# EAGLE design Cookie Synth (EAGLE 6.2)
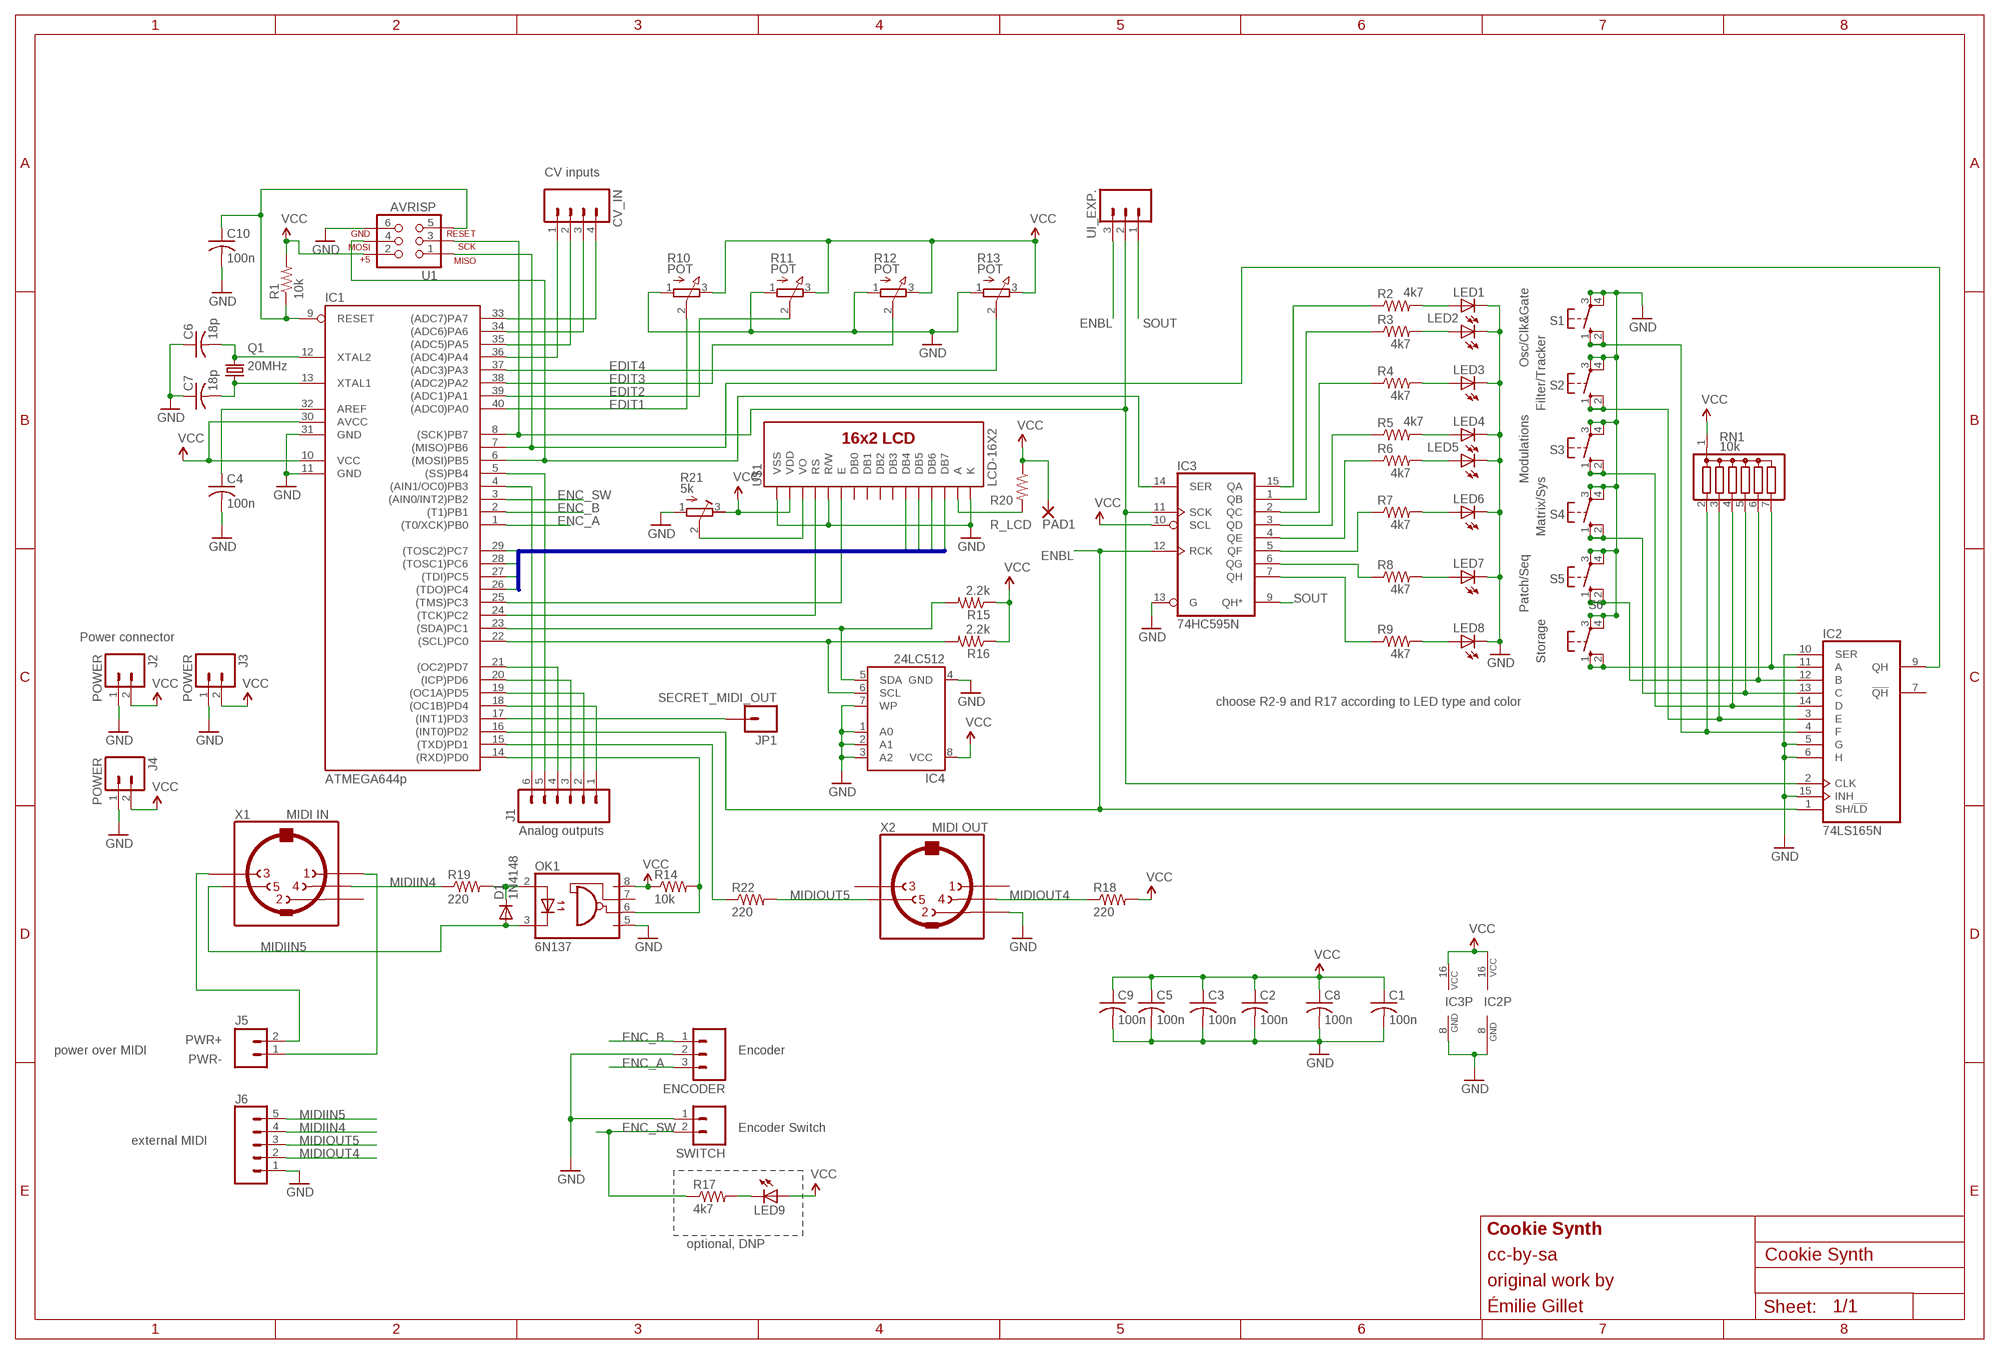
[diagram p0: schematic, sheet 1]

## Parts
C1  100n  C-US025-024X044  [C025-024X044]
C2  100n  C-US025-024X044  [C025-024X044]
C3  100n  C-US025-024X044  [C025-024X044]
C4  100n  C-US025-024X044  [C025-024X044]
C5  100n  C-US025-024X044  [C025-024X044]
C6  18p  C-US025-024X044  [C025-024X044]
C7  18p  C-US025-024X044  [C025-024X044]
C8  100n  C-US025-024X044  [C025-024X044]
C9  100n  C-US025-024X044  [C025-024X044]
C10  100n  C-US025-024X044  [C025-024X044]
CV_IN  M04PTH  [1X04]
D1  1N4148  DIODE-D-5  [D-5]
ENCODER  M03PTH  [1X03]
IC1  ATMEGA644p  MEGA16-P  [DIL40]
IC2  74LS165N  [DIL16]
IC3  74HC595N  [DIL16]
IC4  24LC512  AT24CP  [DIL08]
J1  M06SIP  [1X06]
J2  POWER  M02PTH  [1X02]
J3  POWER  M02PTH  [1X02]
J4  POWER  M02PTH  [1X02]
J5  M02PTH  [1X02]
J6  CONN_05  [1X05]
JP1  SECRET_MIDI_OUT  M01PTH  [1X01]
LED1  LED3MM  [LED3MM]
LED2  LED3MM  [LED3MM]
LED3  LED3MM  [LED3MM]
LED4  LED3MM  [LED3MM]
LED5  LED3MM  [LED3MM]
LED6  LED3MM  [LED3MM]
LED7  LED3MM  [LED3MM]
LED8  LED3MM  [LED3MM]
LED9  LED3MM  [LED3MM]
OK1  6N137  [DIL08]
PAD1  1,6/0,8  [1,6/0,8]
Q1  20MHz  CRYSTALHC49U-V  [HC49U-V]
R1  10k  R-US_0204/7  [0204/7]
R2  4k7  R-US_0204/7  [0204/7]
R3  4k7  R-US_0204/7  [0204/7]
R4  4k7  R-US_0204/7  [0204/7]
R5  4k7  R-US_0204/7  [0204/7]
R6  4k7  R-US_0204/7  [0204/7]
R7  4k7  R-US_0204/7  [0204/7]
R8  4k7  R-US_0204/7  [0204/7]
R9  4k7  R-US_0204/7  [0204/7]
R10  POT  POTI_ALPS_RK09  [POTI_ALPS_RK09]
R11  POT  POTI_ALPS_RK09  [POTI_ALPS_RK09]
R12  POT  POTI_ALPS_RK09  [POTI_ALPS_RK09]
R13  POT  POTI_ALPS_RK09  [POTI_ALPS_RK09]
R14  10k  R-US_0204/7  [0204/7]
R15  2.2k  R-US_0204/7  [0204/7]
R16  2.2k  R-US_0204/7  [0204/7]
R17  4k7  R-US_0204/7  [0204/7]
R18  220  R-US_0204/7  [0204/7]
R19  220  R-US_0204/7  [0204/7]
R20  R_LCD  R-US_0204/7  [0204/7]
R21  5k  R-TRIMM3296X  [RTRIM3296X]
R22  220  R-US_0204/7  [0204/7]
RN1  10k  G06R  [SIL7]
S1  Osc/Clk&Gate  40-XX  [B3F-40XX]
S2  Filter/Tracker  40-XX  [B3F-40XX]
S3  Modulations  40-XX  [B3F-40XX]
S4  Matrix/Sys  40-XX  [B3F-40XX]
S5  Patch/Seq  40-XX  [B3F-40XX]
S6  Storage  40-XX  [B3F-40XX]
SWITCH  M02PTH  [1X02]
U1  AVRISP  AVR_SPI_PRG_6PTH  [2X3]
U$1  LCD-16X2  [LCD-16X2]
UI_EXP.  M03PTH  [1X03]
X1  MIDI IN  MAB5SH  [MAB5SH]
X2  MIDI OUT  MAB5SH  [MAB5SH]

## Nets
EDIT1: IC1.40((ADC0)PA0) R10.2(S)
EDIT2: IC1.39((ADC1)PA1) R11.2(S)
EDIT3: IC1.38((ADC2)PA2) R12.2(S)
EDIT4: IC1.37((ADC3)PA3) R13.2(S)
ENBL: IC1.16((INT0)PD2) IC2.1(SH/!LD) IC3.12(RCK) UI_EXP..3
ENC_A: ENCODER.3 IC1.1((T0/XCK)PB0)
ENC_B: ENCODER.1 IC1.2((T1)PB1)
ENC_SW: IC1.3((AIN0/INT2)PB2) R17.1 SWITCH.2
GND: C1.2 C2.2 C3.2 C4.2 C5.2 C6.1 C7.1 C8.2 C9.2 C10.2 ENCODER.2 IC1.11(GND) IC1.31(GND) IC2.5(G) IC2.6(H) IC2.8(GND) IC2.10(SER) IC2.15(INH) IC3.8(GND) IC3.13(G) IC4.1(A0) IC4.2(A1) IC4.3(A2) IC4.4(GND) IC4.7(WP) J2.1 J3.1 J4.1 J6.1 LED1.K(C) LED2.K(C) LED3.K(C) LED4.K(C) LED5.K(C) LED6.K(C) LED7.K(C) LED8.K(C) OK1.5(GND) R10.1(A) R11.1(A) R12.1(A) R13.1(A) R21.1(E) S1.3(P) S1.4(P1) S2.3(P) S2.4(P1) S3.3(P) S3.4(P1) S4.3(P) S4.4(P1) S5.3(P) S5.4(P1) S6.3(P) S6.4(P1) SWITCH.1 U1.6 U$1.1(VSS) U$1.5(R/W) U$1.16(K) X2.2
LCD_DATA1: IC1.26((TDO)PC4) U$1.11(DB4)
LCD_DATA2: IC1.27((TDI)PC5) U$1.12(DB5)
LCD_DATA3: IC1.28((TOSC1)PC6) U$1.13(DB6)
LCD_DATA4: IC1.29((TOSC2)PC7) U$1.14(DB7)
MIDIIN4: J6.4 R19.1 X1.4
MIDIIN5: D1.A J6.5 OK1.3(C) X1.5
MIDIOUT4: J6.2 R18.1 X2.4
MIDIOUT5: J6.3 R22.2 X2.5
N$1: IC3.2(QC) R4.1
N$2: IC1.24((TCK)PC2) U$1.4(RS)
N$3: IC2.11(A) RN1.7 S6.1(S) S6.2(S1)
N$4: LED9.K(C) R17.2
N$5: IC2.3(E) RN1.3 S2.1(S) S2.2(S1)
N$6: C10.1 IC1.9(RESET) R1.1 U1.5
N$7: C4.1 IC1.32(AREF)
N$8: IC1.8((SCK)PB7) IC2.2(CLK) IC3.11(SCK) U1.3 UI_EXP..2
N$9: IC1.7((MISO)PB6) IC2.9(QH) U1.1
N$10: CV_IN.1 IC1.36((ADC4)PA4)
N$11: CV_IN.2 IC1.35((ADC5)PA5)
N$12: CV_IN.3 IC1.34((ADC6)PA6)
N$13: CV_IN.4 IC1.33((ADC7)PA7)
N$14: R20.2 U$1.15(A)
N$18: IC1.4((AIN1/OC0)PB3) J1.6
N$19: IC1.5((SS)PB4) J1.5
N$20: IC1.18((OC1B)PD4) J1.1
N$21: IC1.19((OC1A)PD5) J1.2
N$22: IC1.20((ICP)PD6) J1.3
N$23: IC1.21((OC2)PD7) J1.4
N$24: J5.1 X1.1
N$25: IC1.17((INT1)PD3) JP1.1
N$27: IC1.23((SDA)PC1) IC4.5(SDA) R15.2
N$28: D1.C OK1.2(A) R19.2
N$29: J5.2 X1.3
N$30: IC3.15(QA) R2.1
N$31: IC3.1(QB) R3.1
N$32: IC1.22((SCL)PC0) IC4.6(SCL) R16.2
N$33: IC3.3(QD) R5.1
N$34: IC3.4(QE) R6.1
N$35: IC3.5(QF) R7.1
N$36: IC3.7(QH) R9.1
N$37: IC3.6(QG) R8.1
N$42: LED1.A R2.2
N$43: LED2.A R3.2
N$44: LED3.A R4.2
N$45: LED4.A R5.2
N$46: LED5.A R6.2
N$47: LED6.A R7.2
N$48: LED7.A R8.2
N$49: LED8.A R9.2
N$57: IC1.6((MOSI)PB5) IC3.14(SER) U1.4
N$59: IC2.4(F) RN1.2 S1.1(S) S1.2(S1)
N$61: IC2.14(D) RN1.4 S3.1(S) S3.2(S1)
N$62: IC2.13(C) RN1.5 S4.1(S) S4.2(S1)
N$63: IC2.12(B) RN1.6 S5.1(S) S5.2(S1)
N$76: IC1.25((TMS)PC3) U$1.6(E)
N$78: R21.2(S) U$1.3(VO)
N$82: C7.2 IC1.13(XTAL1) Q1.1
N$83: C6.2 IC1.12(XTAL2) Q1.2
RXD: IC1.14((RXD)PD0) OK1.6(VO) R14.2
SOUT: IC3.9(QH*) UI_EXP..1
TXD: IC1.15((TXD)PD1) R22.1
VCC: C1.1 C2.1 C3.1 C5.1 C8.1 C9.1 IC1.10(VCC) IC1.30(AVCC) IC2.16(VCC) IC3.10(SCL) IC3.16(VCC) IC4.8(VCC) J2.2 J3.2 J4.2 LED9.A OK1.8(VCC) PAD1.1(P) R1.2 R10.3(E) R11.3(E) R12.3(E) R13.3(E) R14.1 R15.1 R16.1 R18.2 R20.1 R21.3(A) RN1.1 U1.2 U$1.2(VDD)
Unconnected: IC2.7(!QH) OK1.7(VE) U$1.7(DB0) U$1.8(DB1) U$1.9(DB2) U$1.10(DB3) X1.2 X2.1 X2.3

## Buses
LCD_DATA[1..4]

## Notes on the sheet
- CV inputs
- Power connector
- choose R2-9 and R17 according to LED type and color
- Analog outputs
- PWR+
- power over MIDI | PWR- | Encoder
- Encoder Switch
- external MIDI
- Cookie Synth
- optional, DNP
- cc-by-sa
- original work by
- Émilie Gillet

## Library data of the parts
C1-C10 = rcl:C-US: CAPACITOR, American symbol
CV_IN = SparkFun:M04: Header 4 Standard 4-pin 0.1" header. Use with straight break away headers (SKU : PRT-00116), right angle break away headers (PRT-00553), swiss pins (PRT-00743), machine pins (PRT-00117), and female headers (PRT-00115). Molex polarized connector foot print use with SKU : PRT-08231 with associated crimp pins and housings.
D1 = diode:DIODE-: DIODE
ENCODER UI_EXP. = SparkFun:M03: Header 3 Standard 3-pin 0.1" header. Use with straight break away headers (SKU : PRT-00116), right angle break away headers (PRT-00553), swiss pins (PRT-00743), machine pins (PRT-00117), and female headers (PRT-00115). Molex polarized connector foot print use with SKU : PRT-08232 with associated crimp pins and housings.
IC1 = atmel:MEGA16-P: MICROCONTROLLER 16 Kbytes FLASH 1 kbytes SRAM 512 bytes EEPROM USART 8-channel 10 bit ADC Source: avr.lbr
IC2 = 74xx-us:74*165: 8-bit parallel load SHIFT REGISTER
IC3 = 74xx-eu:74*595: 8-bit SHIFT REGISTER, output latch
IC4 = atmel:AT24C*: 2-wire serial EEPROM
J1 = SparkFun:M06: Header 6 Standard 6-pin 0.1" header. Use with straight break away headers (SKU : PRT-00116), right angle break away headers (PRT-00553), swiss pins (PRT-00743), machine pins (PRT-00117), and female headers (PRT-00115). Molex polarized connector foot print use with SKU : PRT-08094 with associated crimp pins and housings. NOTES ON THE VARIANTS LOCK and LOCK_LONGPADS... This footprint was designed to help hold the alignment of a through-hole component (i.e. 6-pin header) while soldering it into place. You may notice that each hole has been shifted either up or down by 0.005 of an inch from it's more standard position (which is a perfectly straight line). This slight alteration caused the pins (the squares in the middle) to touch the edges of the holes. Because they are alternating, it causes a "brace" to hold the component in place. 0.005 has proven to be the perfect amount of "off-center" position when using our standard breakaway headers. Although looks a little odd when you look at the bare footprint, once you have a header in there, the alteration is very hard to notice. Also, if you push a header all the way into place, it is covered up entirely on the bottom side. This idea of altering the position of holes to aid alignment will be further integrated into the Sparkfun Library for other footprints. It can help hold any component with 3 or more connection pins.
J2-J5 SWITCH = SparkFun:M02: Header 2 Standard 2-pin 0.1" header. Use with straight break away headers (SKU : PRT-00116), right angle break away headers (PRT-00553), swiss pins (PRT-00743), machine pins (PRT-00117), and female headers (PRT-00115). Molex polarized connector foot print use with SKU : PRT-08233 with associated crimp pins and housings.
J6 = Connectors:CONN_05: Multi connection point. Often used as Generic Header-pin footprint for 0.1 inch spaced/style header connections On any of the 0.1 inch spaced packages, you can populate with these: Break Away Headers - Straight <https://www.sparkfun.com/products/116> (PRT-00116) Break Away Male Headers - Right Angle <https://www.sparkfun.com/products/553> (PRT-00553) Female Headers <https://www.sparkfun.com/products/115> (PRT-00115) Break Away Headers - Machine Pin <https://www.sparkfun.com/products/117> (PRT-00117) Break Away Female Headers - Swiss Machine Pin <https://www.sparkfun.com/products/743> (PRT-00743) For SCREWTERMINALS and SPRING TERMINALS visit here: Screw Terimnals on SparkFun.com <https://www.sparkfun.com/search/results?term=Screw+Terminals> (5mm/3.5mm/2.54mm spacing) This device is also useful as a general connection point to wire up your design to another part of your project. Our various solder wires solder well into these plated through hole pads. Hook-Up Wire - Assortment (Stranded, 22 AWG) <https://www.sparkfun.com/products/11375> (PRT-11375) Hook-Up Wire - Assortment (Solid Core, 22 AWG) <https://www.sparkfun.com/products/11367> (PRT-11367) View the entire wire category on our website here <https://www.sparkfun.com/categories/141> Special notes: Molex polarized connector foot print use with SKU : PRT-08231 with associated crimp pins and housings. 1MM SMD Version SKU: PRT-10208
JP1 = SparkFun:M01: Header 1 Standard 1-pin 0.1" header. Use with straight break away headers (SKU : PRT-00116), right angle break away headers (PRT-00553), swiss pins (PRT-00743), machine pins (PRT-00117), and female headers (PRT-00115).
LED1-LED9 = led:LED: LED OSRAM: - CHIPLED LG R971, LG N971, LY N971, LG Q971, LY Q971, LO R971, LY R971 LH N974, LH R974 LS Q976, LO Q976, LY Q976 LO Q996 - Hyper CHIPLED LW Q18S LB Q993, LB Q99A, LB R99A - SideLED LS A670, LO A670, LY A670, LG A670, LP A670 LB A673, LV A673, LT A673, LW A673 LH A674 LY A675 LS A676, LA A676, LO A676, LY A676, LW A676 LS A679, LY A679, LG A679 - Hyper Micro SIDELED® LS Y876, LA Y876, LO Y876, LY Y876 LT Y87S - SmartLED LW L88C, LW L88S LB L89C, LB L89S, LG L890 LS L89K, LO L89K, LY L89K LS L896, LA L896, LO L896, LY L896 - TOPLED LS T670, LO T670, LY T670, LG T670, LP T670 LSG T670, LSP T670, LSY T670, LOP T670, LYG T670 LG T671, LOG T671, LSG T671 LB T673, LV T673, LT T673, LW T673 LH T674 LS T676, LA T676, LO T676, LY T676, LB T676, LH T676, LSB T676, LW T676 LB T67C, LV T67C, LT T67C, LS T67K, LO T67K, LY T67K, LW E67C LS E67B, LA E67B, LO E67B, LY E67B, LB E67C, LV E67C, LT E67C LW T67C LS T679, LY T679, LG T679 LS T770, LO T770, LY T770, LG T770, LP T770 LB T773, LV T773, LT T773, LW T773 LH T774 LS E675, LA E675, LY E675, LS T675 LS T776, LA T776, LO T776, LY T776, LB T776 LHGB T686 LT T68C, LB T68C - Hyper Mini TOPLED® LB M676 - Mini TOPLED Santana® LG M470 LS M47K, LO M47K, LY M47K Source: http://www.osram.convergy.de LUXEON: - LUMILED® LXK2-PW12-R00, LXK2-PW12-S00, LXK2-PW14-U00, LXK2-PW14-V00 LXK2-PM12-R00, LXK2-PM12-S00, LXK2-PM14-U00 LXK2-PE12-Q00, LXK2-PE12-R00, LXK2-PE12-S00, LXK2-PE14-T00, LXK2-PE14-U00 LXK2-PB12-K00, LXK2-PB12-L00, LXK2-PB12-M00, LXK2-PB14-N00, LXK2-PB14-P00, LXK2-PB14-Q00 LXK2-PR12-L00, LXK2-PR12-M00, LXK2-PR14-Q00, LXK2-PR14-R00 LXK2-PD12-Q00, LXK2-PD12-R00, LXK2-PD12-S00 LXK2-PH12-R00, LXK2-PH12-S00 LXK2-PL12-P00, LXK2-PL12-Q00, LXK2-PL12-R00 Source: www.luxeon.com KINGBRIGHT: KA-3528ASYC Source: www.kingbright.com
OK1 = optocoupler:6N137: MOTOROLA OPTO COUPLER
PAD1 = wirepad:1,6/0,8: THROUGH-HOLE PAD
Q1 = crystal:CRYSTAL: CRYSTAL
R1-R9 R14-R20 R22 = rcl:R-US_: RESISTOR, American symbol
R10-R13 = FA_potentiometer:POTI_ALPS_RK09: Potentiometer
R21 = rcl:R-TRIMM: Trimm resistor
RN1 = resistor-sil:G06R: SIL RESISTOR
S1-S6 = og-switch:40-XX: OMRON SWITCH
U1 = SparkFun:AVR_SPI_PRG_6: AVR ISP 6 Pin This is the reduced ISP connector for AVR programming. Common on Arduino. This footprint will take up less PCB space and can be used with a 10-pin to 6-pin adapter such as SKU: BOB-08508
U$1 = SparkFun:LCD-16X2
X1 X2 = og-midi:MAB5SH: Female CONNECTOR 5 pins 90 deg. with shield, horizontal (DIN 41524)

## Board
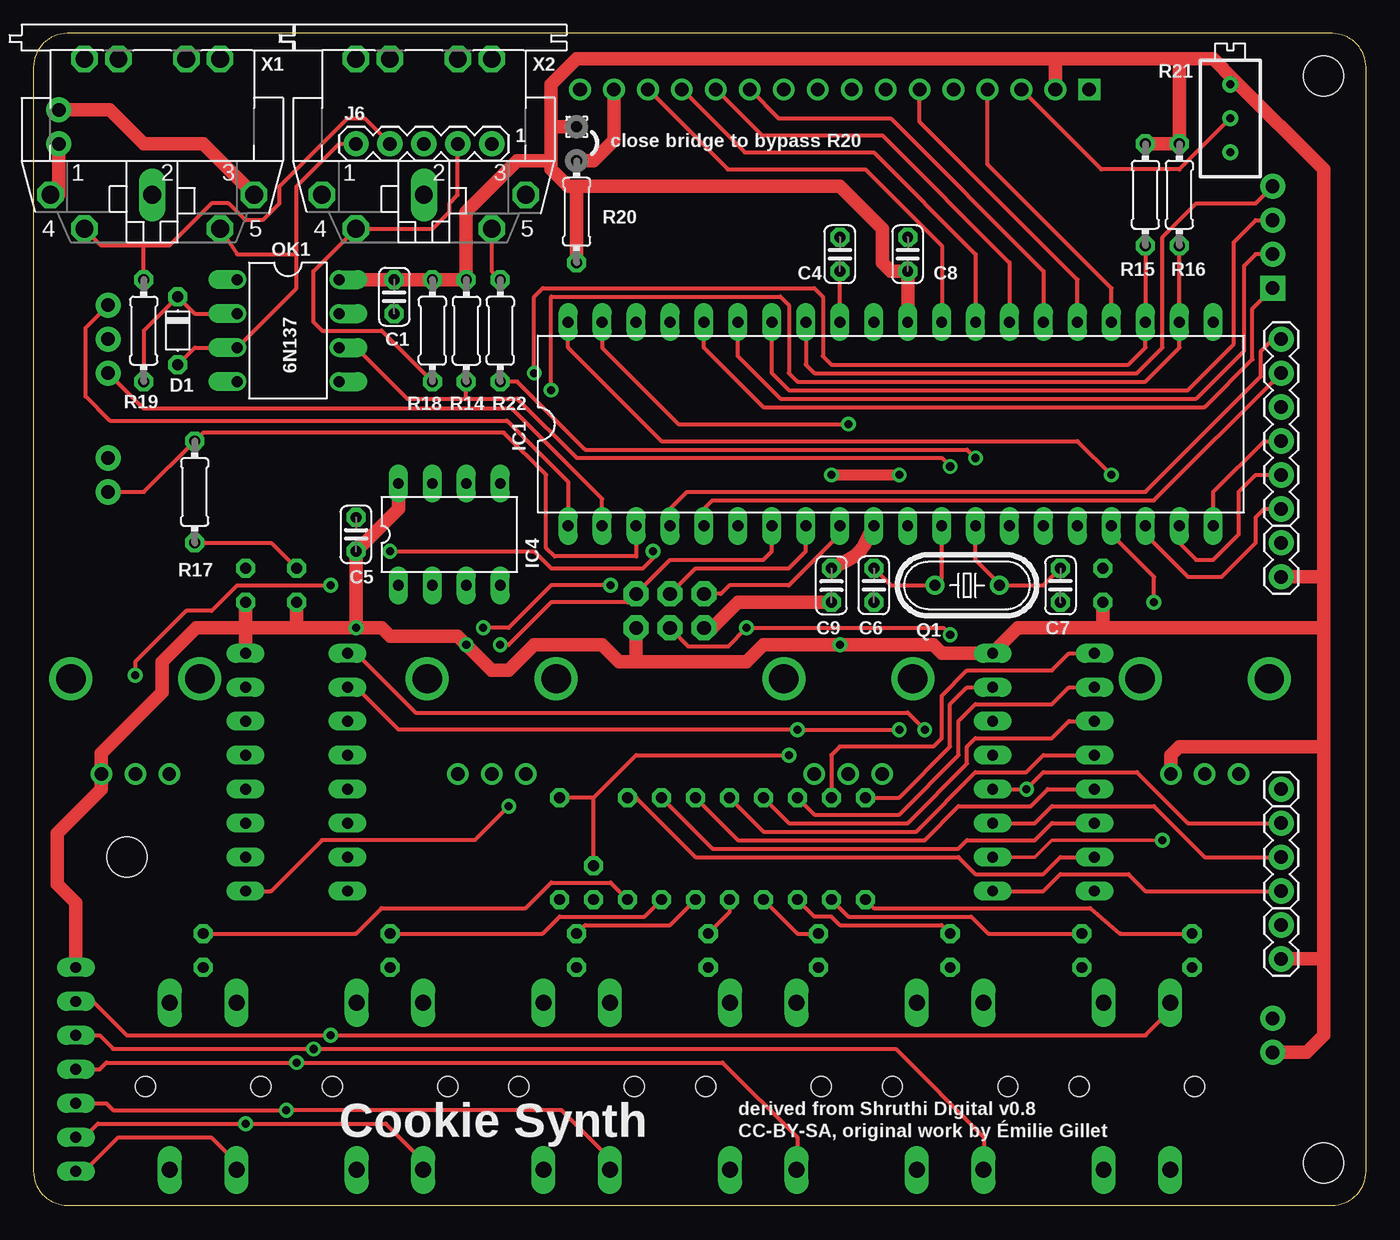
[diagram p1: board, top side]
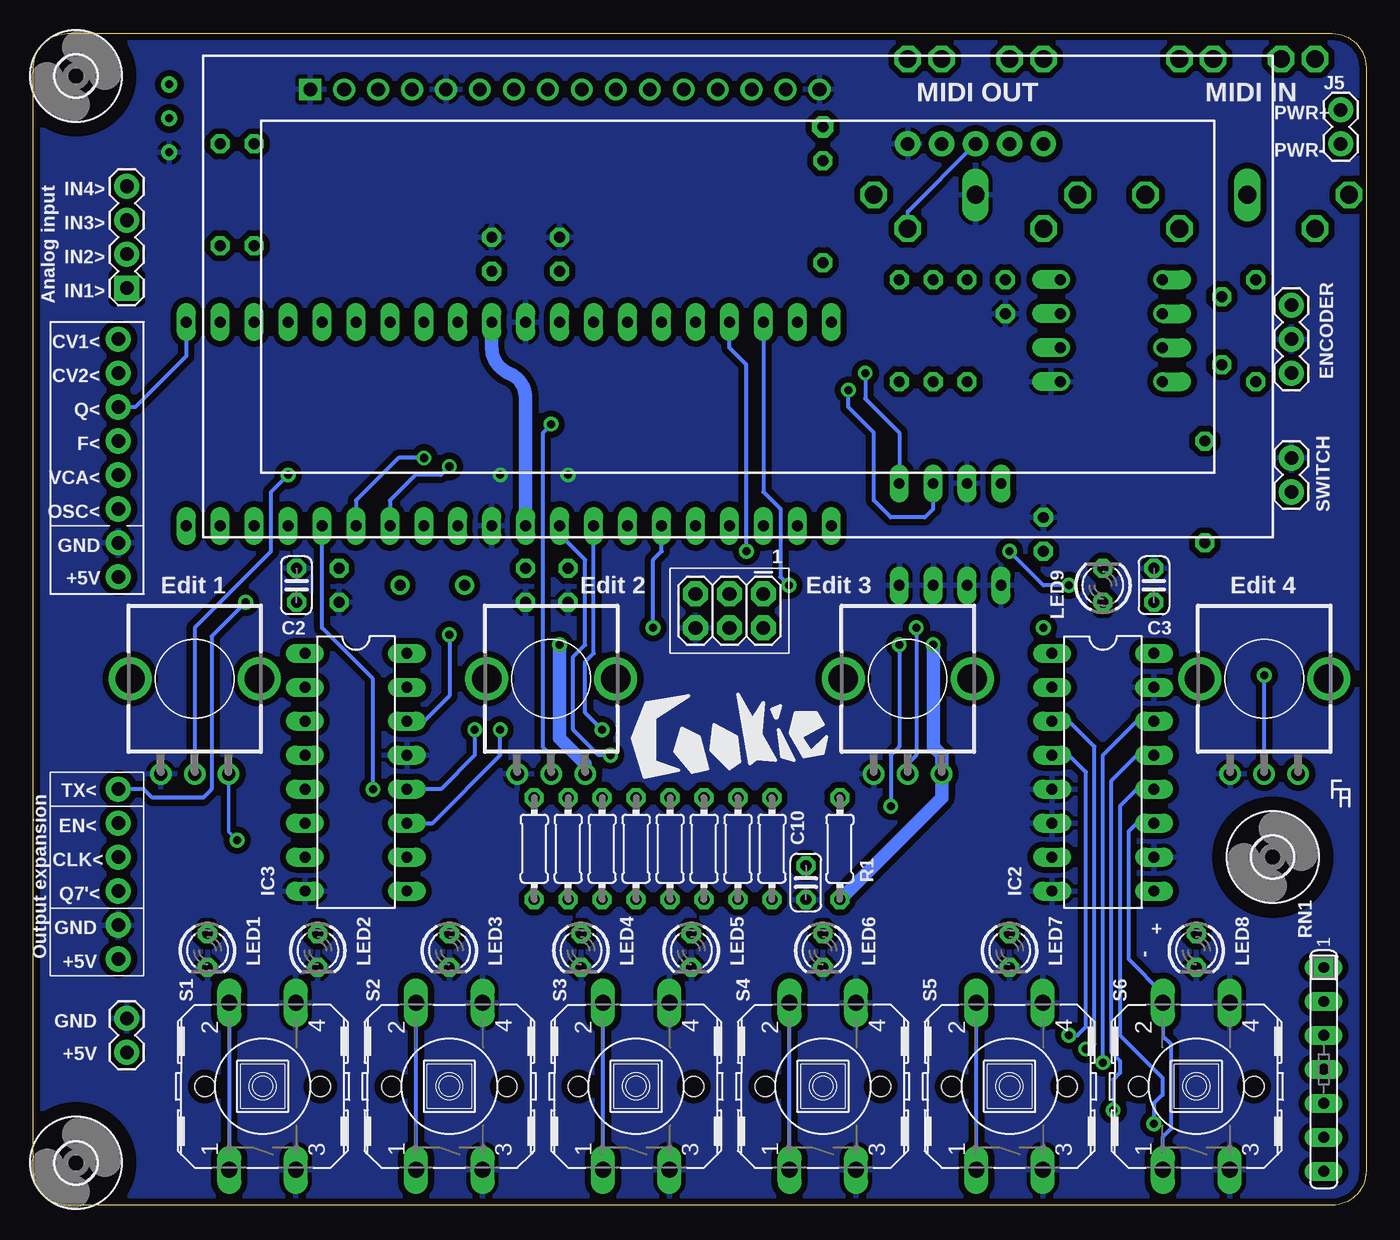
[diagram p2: board, bottom side, seen from below]

Size 99.7 x 87.63 mm. Coordinates in mm from the lower left corner, seen from the top.
Outline: 97.16,0 arc90 99.7,2.54 99.7,85.09 arc90 97.16,87.63 2.54,87.63 arc90 0,85.09 0,2.54 arc90 2.54,0 97.16,0
Copper layers (1*16): Top 0.035mm / dielectric 1.5mm / Bottom 0.035mm
Design rules: minimum track width 10mil, minimum drill 20mil, track to track 10mil, track to pad 10mil, pad to pad 10mil, via to via 10mil, smd to smd 8mil, copper to edge 20mil, drill to drill 20mil, minimum pad ring 12mil, minimum via ring 10mil, stop-mask expansion 4mil, vias tented up to drill 25mil, thermal gap 12mil
Holes 1.5 mm at 17.02,8.89 8.38,8.89 30.99,8.89 22.35,8.89 44.96,8.89 36.32,8.89 72.9,8.89 64.26,8.89 86.87,8.89 78.23,8.89 58.93,8.89 50.29,8.89
tKeepout: area 13.9,74.9 to 21.9,80.9; area 42.9,74.9 to 50.9,80.9; area 71.9,74.9 to 79.9,80.9; area 13.8,53.1 to 21.8,59.1; area 42.8,53.1 to 50.8,59.1; area 71.8,53.1 to 79.8,59.1

### Footprints (pad centres in the part's own frame; a part is rotated, then mirrored left to right if it is on the bottom)
C025-024X044 = drill 0.813 octagon: 1 -1.27,0; 2 1.27,0
1X04 = drill 1.016 pad 1.88 square: 1 0,0 | drill 1.016 pad 1.88: 2 2.54,0; 3 5.08,0; 4 7.62,0
D-5 = drill 0.813 octagon: A 2.54,0; C -2.54,0
1X03 = drill 1.016 pad 1.88: 1 0,0; 2 2.54,0; 3 5.08,0
DIL40 = drill 0.813 long: 1 -24.13,-7.62; 2 -21.59,-7.62; 3 -19.05,-7.62; 4 -16.51,-7.62; 5 -13.97,-7.62; 6 -11.43,-7.62; 7 -8.89,-7.62; 8 -6.35,-7.62; 9 -3.81,-7.62; 10 -1.27,-7.62; 11 1.27,-7.62; 12 3.81,-7.62; 13 6.35,-7.62; 14 8.89,-7.62; 15 11.43,-7.62; 16 13.97,-7.62; 17 16.51,-7.62; 18 19.05,-7.62; 19 21.59,-7.62; 20 24.13,-7.62; 21 24.13,7.62; 22 21.59,7.62; 23 19.05,7.62; 24 16.51,7.62; 25 13.97,7.62; 26 11.43,7.62; 27 8.89,7.62; 28 6.35,7.62; 29 3.81,7.62; 30 1.27,7.62; 31 -1.27,7.62; 32 -3.81,7.62; 33 -6.35,7.62; 34 -8.89,7.62; 35 -11.43,7.62; 36 -13.97,7.62; 37 -16.51,7.62; 38 -19.05,7.62; 39 -21.59,7.62; 40 -24.13,7.62
DIL16 = drill 0.813 long: 1 -8.89,-3.81; 2 -6.35,-3.81; 3 -3.81,-3.81; 4 -1.27,-3.81; 5 1.27,-3.81; 6 3.81,-3.81; 7 6.35,-3.81; 8 8.89,-3.81; 9 8.89,3.81; 10 6.35,3.81; 11 3.81,3.81; 12 1.27,3.81; 13 -1.27,3.81; 14 -3.81,3.81; 15 -6.35,3.81; 16 -8.89,3.81
DIL08 = drill 0.813 long: 1 -3.81,-3.81; 2 -1.27,-3.81; 3 1.27,-3.81; 4 3.81,-3.81; 5 3.81,3.81; 6 1.27,3.81; 7 -1.27,3.81; 8 -3.81,3.81
1X06 = drill 1.016 pad 1.88: 1 0,0; 2 2.54,0; 3 5.08,0; 4 7.62,0; 5 10.16,0; 6 12.7,0
1X02 = drill 1.016 pad 1.88: 1 0,0; 2 2.54,0
1X05 = drill 1.016 pad 1.88: 1 0,0; 2 2.54,0; 3 5.08,0; 4 7.62,0; 5 10.16,0
1X01 = drill 1.016 pad 1.88: 1 0,0
LED3MM = drill 0.813 octagon: A -1.27,0; K 1.27,0
DIL08' = drill 0.813 offset: 1 -3.81,-3.81; 2 -1.27,-3.81; 3 1.27,-3.81; 4 3.81,-3.81; 5 3.81,3.81; 6 1.27,3.81; 7 -1.27,3.81; 8 -3.81,3.81
1,6/0,8 = drill 0.813 pad 1.6 octagon: 1 0,0
HC49U-V = drill 0.813: 1 -2.413,0; 2 2.413,0
0204/7 = drill 0.813 octagon: 1 -3.81,0; 2 3.81,0
POTI_ALPS_RK09 = drill 1: 1 -2.54,-7.112; 2 0,-7.112; 3 2.54,-7.112 | drill 2.2: TAB1 -4.826,0; TAB2 4.826,0
RTRIM3296X = drill 0.61: 1 0,-2.54; 2 0,0; 3 0,2.54
SIL7 = drill 0.813 long: 1 -7.62,0; 2 -5.08,0; 3 -2.54,0; 4 0,0; 5 2.54,0; 6 5.08,0; 7 7.62,0
B3F-40XX = drill 1.194 long: 1 -6.248,2.489; 2 6.248,2.489; 3 -6.248,-2.489; 4 6.248,-2.489
2X3 = drill 1.016 pad 1.88 octagon: 1 0,0; 2 0,2.54; 3 2.54,0; 4 2.54,2.54; 5 5.08,0; 6 5.08,2.54
LCD-16X2 = drill 1.016 square: 1 -32,15.5 | drill 1.016: 2 -29.46,15.5; 3 -26.92,15.5; 4 -24.38,15.5; 5 -21.84,15.5; 6 -19.3,15.5; 7 -16.76,15.5; 8 -14.22,15.5; 9 -11.68,15.5; 10 -9.14,15.5; 11 -6.6,15.5; 12 -4.06,15.5; 13 -1.52,15.5; 14 1.02,15.5; 15 3.56,15.5; 16 6.1,15.5
3,0 = hole 3: 0,0
MAB5SH = drill 1.321 octagon: 1 7.62,7.62; 3 -7.62,7.62; 4 5.08,10.16; 5 -5.08,10.16; P$1 -5.08,-2.54; P$2 -2.54,-2.54; P$3 2.54,-2.54; P$4 5.08,-2.54 | drill 1.321 long: 2 0,7.62

### Placement (x,y rotation side)
C1  26.99,67.95 270 top
C2  80.01,46.35 90 bottom
C3  15.87,46.35 90 bottom
C4  60.32,71.12 90 top
C5  24.13,50.16 90 top
C6  62.87,46.35 90 top
C7  76.84,46.35 90 top
C8  65.41,71.12 90 top
C9  59.69,46.35 270 top
C10  41.91,24.13 270 bottom
CV_IN  92.71,68.58 90 bottom
D1  10.79,65.41 270 top
ENCODER  5.59,62.23 90 bottom
IC1  64.14,58.42 0 top
IC2  19.69,32.38 270 bottom
IC3  75.56,32.38 270 bottom
IC4  31.11,50.16 0 top
J1  93.34,52.07 90 top
J2  93.34,49.53 270 top
J3  92.71,13.97 270 bottom
J4  93.34,20.95 270 top
J5  1.9,79.38 90 bottom
J6  34.29,79.38 180 top
JP1  93.34,31.11 90 top
LED1  86.68,19.05 270 bottom
LED2  78.42,19.05 270 bottom
LED3  68.58,19.05 270 bottom
LED4  58.74,19.05 270 bottom
LED5  50.48,19.05 270 bottom
LED6  40.64,19.05 270 bottom
LED7  26.67,19.05 270 bottom
LED8  12.7,19.05 270 bottom
LED9  19.69,46.35 90 bottom
OK1  6N137  [DIL08']  19.05,65.41 270 top
PAD1  40.64,80.65 0 top
Q1  69.85,46.35 180 top
R1  39.37,26.67 270 bottom
R2  62.23,26.67 270 bottom
R3  59.69,26.67 270 bottom
R4  57.15,26.67 270 bottom
R5  54.61,26.67 270 bottom
R6  52.07,26.67 270 bottom
R7  49.53,26.67 270 bottom
R8  46.99,26.67 270 bottom
R9  44.45,26.67 270 bottom
R10  87.63,39.37 0 bottom
R11  60.96,39.37 0 bottom
R12  34.29,39.37 0 bottom
R13  7.62,39.37 0 bottom
R14  32.38,65.41 270 top
R15  83.19,75.57 270 top
R16  85.73,75.57 270 top
R17  12.06,53.34 270 top
R18  29.84,65.41 90 top
R19  8.26,65.41 270 top
R20  40.64,74.3 90 top
R21  89.54,81.28 0 top
R22  34.92,65.41 90 top
RN1  3.17,10.16 270 bottom
S1  82.55,8.89 90 bottom
S2  68.58,8.89 90 bottom
S3  54.61,8.89 90 bottom
S4  40.64,8.89 90 bottom
S5  26.67,8.89 90 bottom
S6  12.7,8.89 90 bottom
SWITCH  5.59,55.88 270 bottom
U1  45.09,45.72 180 bottom
U$1  46.99,67.95 0 bottom
U$2  [3,0]  96.52,84.46 0 bottom
U$3  [3,0]  96.52,3.17 0 bottom
U$4  [3,0]  6.98,26.04 0 bottom
UI_EXP.  93.34,23.49 90 top
X1  8.89,83.19 180 top
X2  29.21,83.19 180 top

### Tracks (layer width: path | path; a pad name or v marks a point on that pad's centre or on a via)
EDIT1  (via drill 0.6)
  Top 0.305: v80.65,54.61 78.11,57.15 46.99,57.15 40,64.14 IC1.40
  Bottom 0.305: v80.65,54.61 81.92,53.34 81.92,48.89 87.63,43.18 R10.2
EDIT2  (via drill 0.6)
  Top 0.305: IC1.39 42.54,64.14 48.26,58.42 v60.96,58.42
  Bottom 0.305: R11.2 60.96,33.66 61.59,34.29 61.59,57.72 v60.96,58.42
EDIT3  (via drill 0.6)
  Top 0.305: v43.18,46.35 38.73,46.35 35.56,43.18 v33.65,43.18
  Bottom 0.305: IC1.38 45.09,53.34 43.81,52.07 43.81,46.99 v43.18,46.35 | v33.65,43.18 33.65,33.66 34.29,33.02 R12.2
EDIT4  (via drill 0.6)
  Top 0.305: v46.35,48.89 46.35,48.39 45.59,47.62 38.73,47.62 37.46,48.89 v26.67,48.89 | v7.62,39.62 7.62,40.64 11.43,44.45 13.33,44.45 15.24,46.35 v22.23,46.35
  Bottom 0.305: R13.2 v7.62,39.62 | IC1.37 47.62,64.14 46.35,62.87 v46.35,48.89 | v22.23,46.35 24.13,46.35 v26.67,48.89
ENBL  (via drill 0.6)
  Top 0.305: v66.68,35.56 65.41,36.83 28.57,36.83 24.13,41.27 IC2.1 | IC3.12 v74.3,31.11 75.56,32.38 82.55,32.38 86.36,28.57 UI_EXP..3
  Bottom 0.305: v74.3,31.11 74.3,39.37 78.11,43.18 IC1.16 | v66.68,35.56 66.68,33.66 69.22,31.11 IC3.12
ENC_A
  Top 0.305: IC1.1 40,54.1 35.43,58.67 5.71,58.67 3.9,60.49 3.9,65.62 ENCODER.3
ENC_B
  Top 0.305: IC1.2 42.54,52.83 35.81,59.56 8.26,59.56 ENCODER.1
ENC_SW
  Top 0.305: IC1.3 45.09,48.51 38.99,48.51 38.35,49.15 38.35,54.61 35.18,57.78 12.7,57.78 R17.1 8.26,53.34 SWITCH.2
GND  (via drill 0.6)
  Top 0.813: v59.69,54.61 v64.77,54.61
  Top 1.016: C9.2 52.7,45.09 50.8,43.18 U1.6
  pour Bottom (isolate 0.457): 0.24,87.04 0.24,0.54 99.25,0.54 99.25,87.04
LCD_DATA1
  Top 0.305: U$1.11 55.76,81.28 64.14,81.28 75.56,69.85 IC1.26
LCD_DATA2
  Top 0.305: U$1.12 54.48,80.01 63.5,80.01 73.03,70.48 IC1.27
LCD_DATA3
  Top 0.305: U$1.13 53.21,78.74 62.87,78.74 70.48,71.12 IC1.28
LCD_DATA4
  Top 0.305: U$1.14 51.95,77.47 62.23,77.47 67.95,71.76 IC1.29
MIDIIN4
  Top 0.305: 8.26,71.76 10.16,71.76 13.33,74.93 14.6,74.93 15.87,73.66 17.14,73.66 18.41,74.93 18.41,76.2 23.49,81.28 24.77,81.28 J6.4 | 8.26,71.76 5.08,71.76 X1.4 | R19.1 8.26,71.76
MIDIIN5
  Top 0.305: D1.A 12.06,64.14 OK1.3 19.69,68.58 19.69,71.12 | X1.5 15.24,71.12 19.69,71.12 | 19.69,71.12 19.69,76.2 22.86,79.38 J6.5
MIDIOUT4
  Top 0.305: R18.1 26.03,65.41 21.59,65.41 20.95,66.04 20.95,69.85 X2.4 29.84,73.03 31.11,74.3 31.11,74.93 31.75,75.57 J6.2
MIDIOUT5
  Top 0.305: X2.5 34.29,69.85 R22.2
  Bottom 0.305: X2.5 34.29,74.3 J6.3
N$1
  Top 0.305: R4.1 58.42,29.21 64.77,29.21 69.22,33.66 69.22,36.2 70.48,37.46 76.2,37.46 77.47,38.73 IC3.2
N$2
  Top 0.305: IC1.24 80.65,68.58 71.37,77.86 U$1.4
N$3
  Top 0.305: S6.1 15.19,3.17 13.28,5.08 6.35,5.08 3.81,2.54 RN1.7
  Bottom 0.254: S6.2 15.19,15.19
  Bottom 0.305: IC2.11 17.14,28.57 17.78,27.94 17.78,18.41 15.19,15.82 S6.2 15.19,12.65 14.6,12.07 14.6,5.71 15.24,5.08 15.24,2.69 S6.1
N$4
  Top 0.305: R17.2 17.78,49.53 LED9.K
N$5  (via drill 0.6)
  Top 0.305: RN1.3 4.95,12.7 5.97,11.68 v20.95,11.68 64.52,11.68 71.12,5.08 71.12,2.69 S2.1
  Bottom 0.305: S2.1 S2.2 | IC2.3 22.23,36.2 20.32,34.29 20.32,12.07 v20.95,11.68
N$6  (via drill 0.6)
  Top 0.305: C10.1 41.91,30.48 | 41.91,30.48 R1.1 | 41.91,30.48 45.09,33.66 v56.51,33.66 | IC1.9 60.32,50.16 56.51,46.35 52.07,46.35 51.43,45.72 U1.5
  Bottom 0.305: v56.51,33.66 57.4,33.66 59.31,35.56 59.31,41.02 58.42,41.91 58.42,48.26 60.32,50.16 IC1.9
N$7
  Top 0.305: IC1.32 C4.1
N$8  (via drill 0.6)
  Top 0.305: v64.77,35.56 v57.15,35.56 27.3,35.56 24.13,38.73 IC2.2 | IC3.11 74.93,28.57 76.2,29.84 83.82,29.84 87.63,26.04 UI_EXP..2 | U1.3 49.53,47.62 56.51,47.62 57.79,48.89 IC1.8
  Bottom 0.305: IC3.11 69.85,28.57 64.77,33.66 v64.77,35.56 | v57.15,35.56 58.42,36.83 58.42,40.64 57.79,41.27 IC1.8
N$9  (via drill 0.6)
  Top 0.305: IC1.7 55.24,48.89 54.61,48.26 47.62,48.26 U1.1 44.45,45.09 38.73,45.09 35.56,41.91 v34.92,41.91 | IC2.9 17.78,23.49 21.59,27.3 33.02,27.3 v35.56,29.84
  Bottom 0.305: v34.92,41.91 34.92,34.29 35.56,33.66 v35.56,29.84
N$10
  Top 0.305: IC1.36 50.16,64.14 54.61,59.69 87.63,59.69 91.19,63.25 91.19,67.06 CV_IN.1
N$11
  Top 0.305: CV_IN.2 91.44,71.12 90.55,70.23 90.55,63.88 87,60.32 55.88,60.32 52.7,63.5 IC1.35
N$12
  Top 0.305: CV_IN.3 91.44,73.66 89.79,72.01 89.79,64.39 86.36,60.96 56.51,60.96 55.24,62.23 IC1.34
N$13
  Top 0.305: IC1.33 57.79,62.87 58.42,62.23 82.55,62.23 84.45,64.14 84.45,72.39 87,74.93 91.44,74.93 CV_IN.4
N$14
  Top 1.016: R20.2 41.91,78.11 43.43,79.62 U$1.15
N$18
  Top 0.305: IC1.4 47.62,52.07 48.89,53.34 83.19,53.34 91.82,61.98 91.82,63.88 92.71,64.77 J1.6
N$19
  Top 0.305: IC1.5 50.16,52.07 50.8,52.7 83.82,52.7 J1.5
N$20
  Top 0.305: IC1.18 83.19,50.16 86.36,46.99 88.9,46.99 91.44,49.53 91.44,51.44 92.08,52.07 J1.1
N$21
  Top 0.305: IC1.19 85.73,49.53 87,48.26 88.27,48.26 90.17,50.16 90.17,53.34 91.44,54.61 J1.2
N$22
  Top 0.305: IC1.20 88.27,53.34 92.08,57.15 J1.3
N$23
  Bottom 0.305: IC1.21 88.27,63.5 92.08,59.69 J1.4
N$24
  Top 1.016: X1.1 1.9,75.57 J5.1
N$25  (via drill 0.6)
  Top 0.305: IC1.17 80.65,50.16 83.82,46.99 v83.82,45.09
  Bottom 0.305: v83.82,45.09 86.36,42.55 86.36,31.11 87,30.48 90.81,30.48 91.44,31.11 JP1.1
N$27  (via drill 0.6)
  Top 0.305: v37.46,62.23 37.46,67.95 38.1,68.58 58.42,68.58 59.05,67.95 59.05,63.5 59.69,62.87 81.92,62.87 83.19,64.14 IC1.23 R15.2
  Bottom 0.305: v37.46,62.23 37.46,60.32 34.92,57.78 IC4.5
N$28
  Top 0.305: R19.2 8.26,65.41 D1.C 12.06,66.68 OK1.2
N$29
  Top 1.016: J5.2 5.71,81.92 8.26,79.38 12.7,79.38 X1.3
N$30
  Top 0.305: R2.1 64.77,30.48 68.58,34.29 68.58,37.46 69.85,38.73 IC3.15
N$31
  Top 0.305: IC3.1 77.47,41.27 76.2,40.01 69.85,40.01 67.95,38.1 67.95,34.92 67.31,34.29 60.32,34.29 59.69,33.66 R3.1
N$32  (via drill 0.6)
  Top 0.305: R16.2 IC1.22 85.73,64.14 83.19,61.59 57.15,61.59 56.51,62.23 56.51,67.31 55.88,67.95 38.73,67.95 v38.73,60.96
  Bottom 0.305: IC4.6 32.38,52.07 33.02,51.44 35.56,51.44 36.83,52.7 36.83,57.78 38.73,59.69 v38.73,60.96
N$33
  Top 0.305: R5.1 56.51,28.57 65.41,28.57 69.85,33.02 69.85,34.29 70.48,34.92 76.2,34.92 77.47,36.2 IC3.3
N$34
  Top 0.305: R6.1 54.61,27.94 66.04,27.94 70.48,32.38 74.3,32.38 75.56,33.66 IC3.4
N$35
  Top 0.305: R7.1 52.7,27.3 66.68,27.3 69.22,29.84 74.61,29.84 75.88,31.11 IC3.5
N$36
  Top 0.305: R9.1 45.09,30.48 49.53,26.04 69.22,26.04 70.48,24.77 75.56,24.77 76.84,26.04 IC3.7
N$37
  Top 0.305: R8.1 50.8,26.67 69.22,26.67 69.85,27.3 74.93,27.3 76.2,28.57 IC3.6
N$42
  Top 0.305: R2.2 62.87,22.22 79.06,22.22 81.28,20.32 LED1.A
N$43
  Top 0.305: R3.2 60.96,21.59 70.17,21.59 71.44,20.32 LED2.A
N$44
  Top 0.305: LED3.A 67.95,20.95 60.32,20.95 59.69,21.59 58.42,21.59 R4.2
N$45
  Top 0.305: R5.2 57.15,20.32 LED4.A
N$46
  Top 0.305: R6.2 52.07,21.91 LED5.A
N$47
  Top 0.305: R7.2 47.62,20.95 41.27,20.95 LED6.A
N$48
  Top 0.305: R8.2 45.72,21.59 39.37,21.59 38.1,20.32 LED7.A
N$49
  Top 0.305: LED8.A 24.13,20.32 26.03,22.22 36.83,22.22 38.73,24.13 43.18,24.13 R9.2
N$57  (via drill 0.6)
  Top 0.305: U1.4 49.02,41.78 51.94,41.78 v53.34,43.18 68.07,43.18 v68.58,42.67
  Bottom 0.305: IC3.14 70.48,36.2 68.58,38.1 v68.58,42.67 | v53.34,43.18 53.34,48.26 52.7,48.89 IC1.6
N$59  (via drill 0.6)
  Top 0.305: S1.2 85.04,14.66 85.09,14.61 83.19,12.7 v22.23,12.7 6.98,12.7 4.44,15.24 RN1.2
  Bottom 0.305: S1.2 S1.1 | IC2.4 22.23,33.66 20.95,32.38 20.95,13.34 21.59,12.7 v22.23,12.7
N$61  (via drill 0.6)
  Top 0.305: RN1.4 4.95,10.16 5.46,10.67 v19.69,10.67 51.56,10.67 57.15,5.08 57.15,2.69 S3.1
  Bottom 0.305: S3.1 S3.2 | IC2.14 17.14,36.2 19.69,33.66 v19.69,10.67
N$62  (via drill 0.6)
  Top 0.305: RN1.5 5.46,7.62 5.97,7.11 v18.92,7.11 39.5,7.11 43.13,3.48 S4.1
  Bottom 0.305: S4.1 S4.2 | IC2.13 17.14,33.66 19.05,31.75 19.05,11.43 18.41,10.8 18.41,9.91 18.92,9.4 v18.92,7.11
N$63  (via drill 0.6)
  Top 0.305: RN1.6 3.81,5.08 4.83,6.1 v15.87,6.1 26.36,6.1 29.16,3.3 S5.1
  Bottom 0.305: S5.1 S5.2 | IC2.12 17.14,31.11 18.41,29.84 18.41,12.7 15.24,9.53 15.24,8.25 15.87,7.62 v15.87,6.1
N$76
  Top 0.305: IC1.25 78.11,69.22 66.29,81.03 U$1.6
N$78
  Top 0.305: R21.2 85.73,77.47 79.89,77.47 U$1.3
N$82
  Top 0.305: C7.2 75.56,46.35 Q1.1 72.26,46.48 70.48,48.26 IC1.13
N$83
  Top 0.305: C6.2 64.14,46.35 Q1.2 67.95,46.86 IC1.12
RXD  (via drill 0.6)
  Top 0.305: v68.58,55.24 67.95,55.88 40.64,55.88 36.2,60.32 32.38,60.32 | 32.38,60.32 R14.2 | 32.38,60.32 27.94,60.32 24.13,64.14 OK1.6
  Bottom 0.305: v68.58,55.24 69.22,54.61 71.12,54.61 73.03,52.7 IC1.14
SOUT
  Top 0.305: IC3.9 75.56,23.49 76.84,24.77 81.92,24.77 83.19,23.49 UI_EXP..1
TXD  (via drill 0.6)
  Top 0.305: v70.48,55.88 69.85,56.52 41.27,56.52 36.2,61.59 R22.1
  Bottom 0.305: v70.48,55.88 72.39,55.88 75.56,52.7 IC1.15
VCC  (via drill 0.6)
  Top 0.254: IC3.10 74.93,26.04 76.2,27.3 v84.45,27.3
  Top 1.016: OK1.8 C1.1 R18.2 R14.1 32.38,74.3 36.2,78.11 38.73,78.11 | 15.87,43.18 12.19,43.18 9.65,40.64 9.65,38.35 5.08,33.78 R13.3 5.08,31.11 1.78,27.81 1.78,24 3.17,22.61 RN1.1 | 15.87,43.18 19.69,43.18 | 19.69,43.18 v24.13,43.18 | 45.09,40.64 43.81,40.64 42.54,41.91 37.46,41.91 35.56,40.01 34.29,40.01 v32.38,41.91 31.75,42.55 26.67,42.55 26.03,43.18 v24.13,43.18 | 45.09,40.64 53.34,40.64 54.61,41.91 v60.32,41.91 67.31,41.91 67.95,41.27 IC3.16 73.66,43.18 80.01,43.18 | 80.01,43.18 C2.1 | 15.87,43.18 C3.1 | 15.87,43.18 IC2.16 | 45.09,40.64 U1.2 | 80.01,43.18 96.52,43.18 | IC1.10 62.23,49.53 arc-37 60.96,48.26 C9.1 | LED9.A 19.69,43.18 | 85.73,85.73 76.2,85.73 | 76.2,85.73 40.64,85.73 38.73,83.82 38.73,80.65 | U$1.2 76.45,85.48 76.2,85.73 | R15.1 R16.1 85.73,85.73 | IC1.30 C8.1 64.14,69.85 63.5,70.48 63.5,73.03 60.32,76.2 40.64,76.2 | IC4.8 27.3,52.07 C5.1 v24.13,43.18 | 96.52,18.41 96.52,12.7 95.25,11.43 J3.2 | 96.52,18.41 96.52,34.29 | 96.52,34.29 96.52,43.18 | R10.3 85.09,33.66 85.73,34.29 96.52,34.29 | 96.52,46.99 96.52,77.47 89.85,84.14 | 96.52,46.99 96.52,43.18 | 96.52,46.99 J2.2 | 85.73,85.73 88.27,85.73 89.85,84.14 | R21.3 89.85,84.14 | J4.2 96.52,18.41 | 40.64,76.2 40,76.2 38.73,77.47 38.73,78.11 | 38.73,80.65 38.73,78.11 | PAD1.1 38.73,80.65 | R20.1 40.64,76.2
  Bottom 0.254: v84.45,27.3 85.09,27.94 R10.3
  Bottom 1.016: IC1.10 62.87,60.32 arc-67 64.14,62.23 arc67 65.41,64.14 IC1.30 | R11.3 58.42,33.02 60.32,34.92 v60.32,41.91 | v32.38,41.91 32.38,34.29 31.75,33.66 R12.3 31.75,30.48 R1.2

### Text on the board
bPlace: IN4> | IN3> | IN2> | IN1> | CV1< | CV2< | Q< | F< | VCA< | OSC< | GND | +5V | Edit 4 | Edit 3 | Edit 2 | Edit 1 | TX< | EN< | CLK< | Q7'< | + | GND | - | +5V | GND | +5V
tNames: 1 | close bridge to bypass R20 | 6N137 | derived from Shruthi Digital v0.8 | Cookie Synth | CC-BY-SA, original work by Émilie Gillet
bNames: MIDI IN | MIDI OUT | PWR+ | PWR- | Analog input | 1 | Output expansion